# EAGLE design freckle (EAGLE 7.2.0)

## Sheet 1 of 2
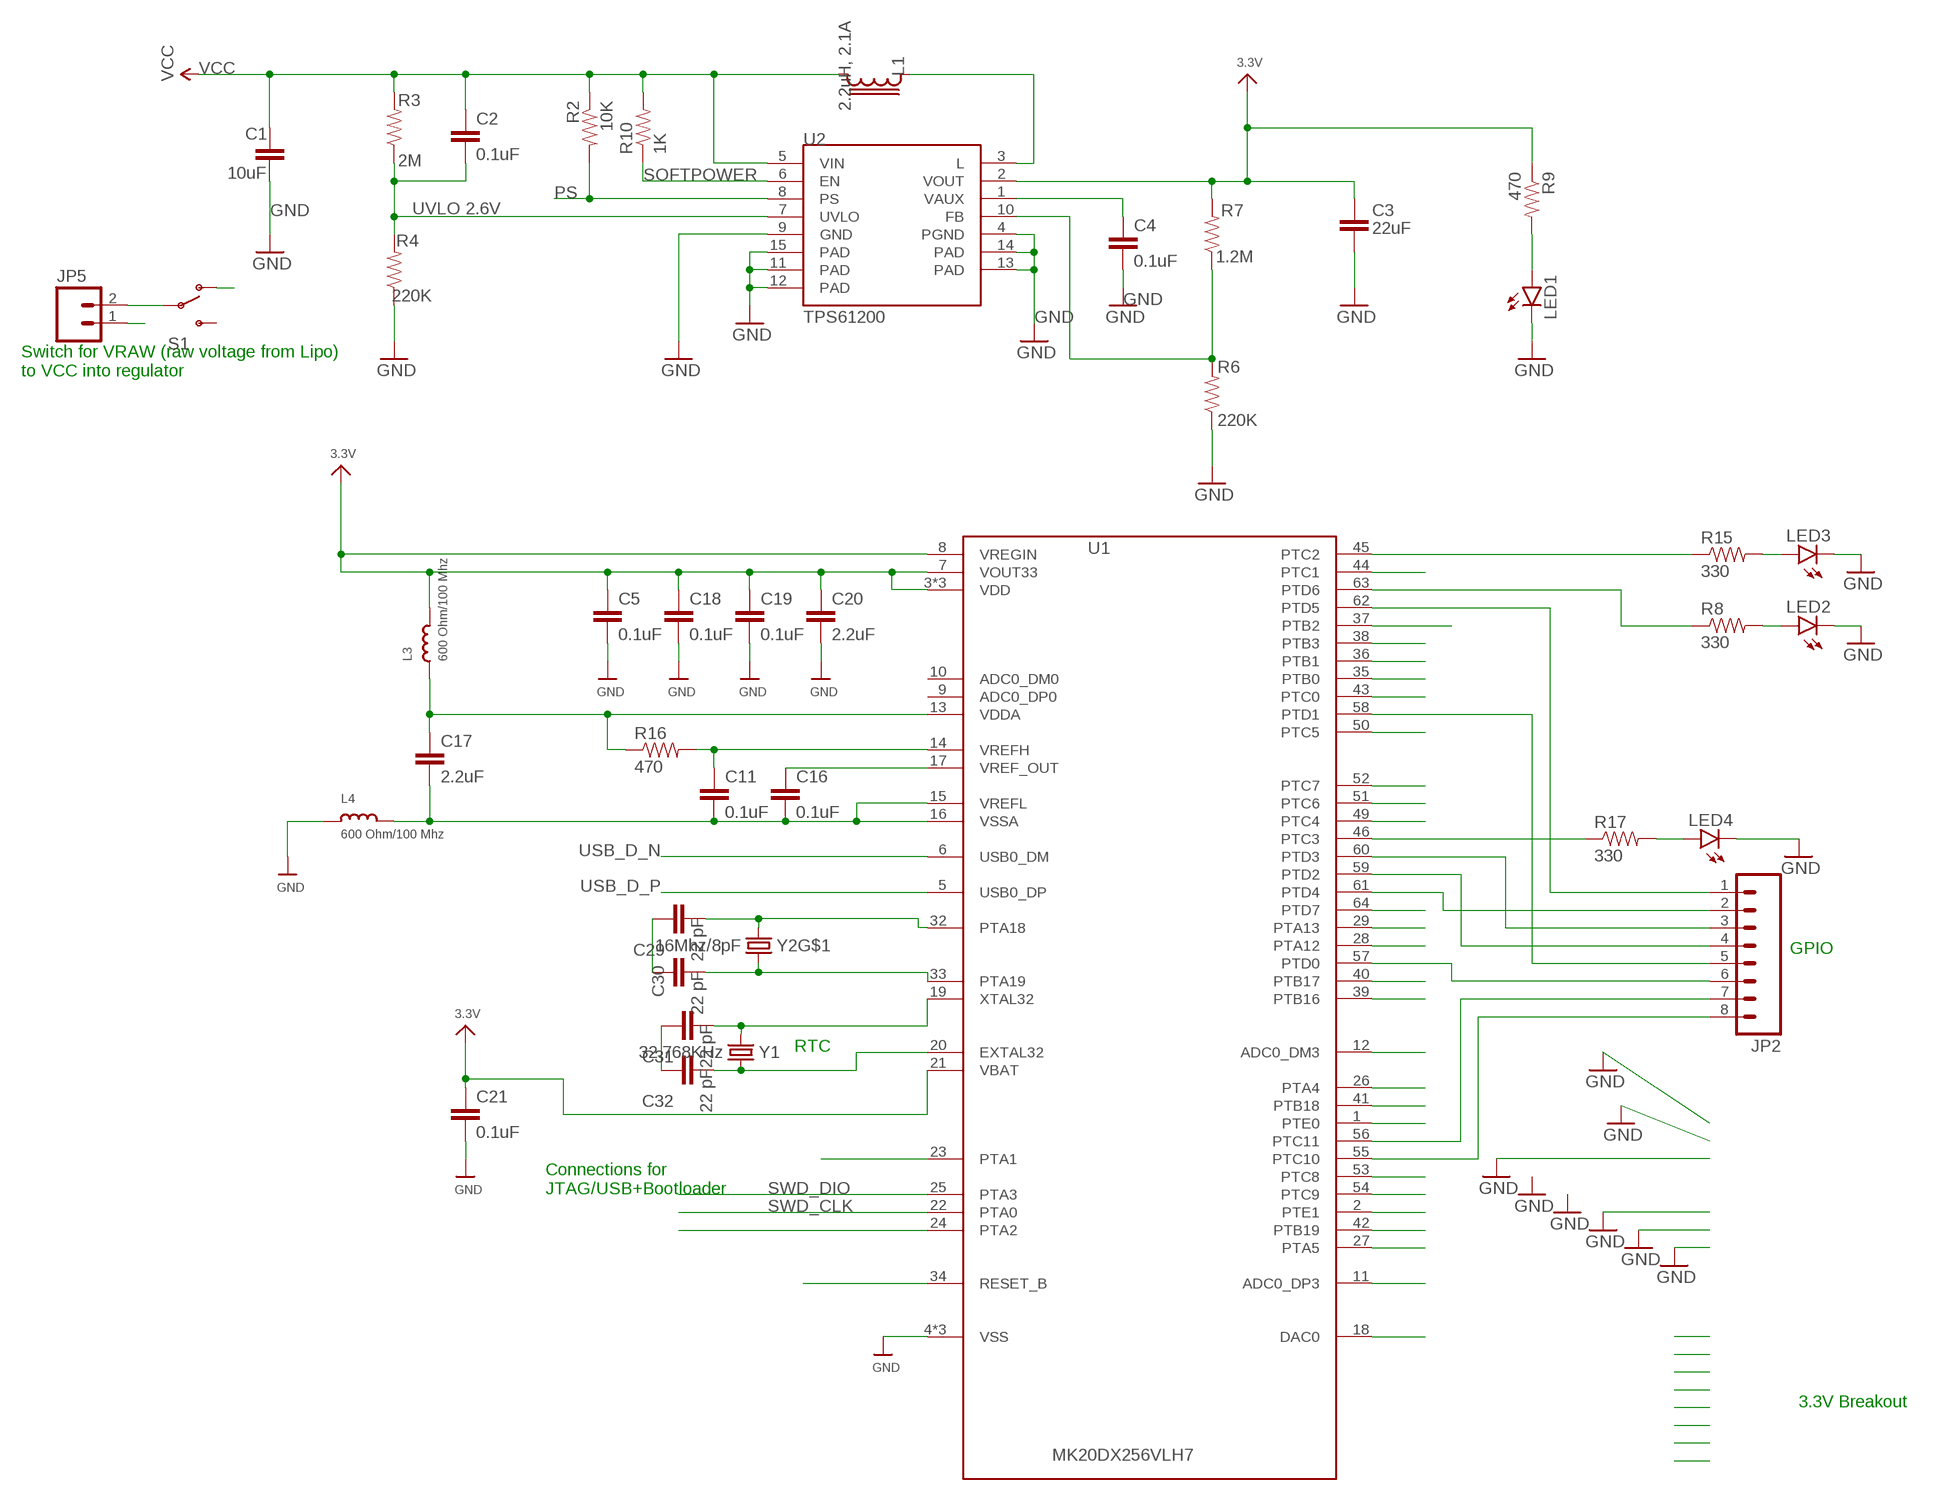
[diagram p0: schematic, sheet 1]

### Parts
C1  10uF  CAPACITOR-10UF  [0603-CAP]
C2  0.1uF  CAPACITOR-0.1UF  [0603-CAP]
C3  22uF  CAPACITOR-22UF  [0603-CAP]
C4  0.1uF  CAPACITOR-0.1UF  [0603-CAP]
C5  0.1uF  CAPACITOR-0.1UF  [0603-CAP]
C11  0.1uF  CAPACITOR-0.1UF  [0603-CAP]
C16  0.1uF  CAPACITOR-0.1UF  [0603-CAP]
C17  2.2uF  CAPACITOR-2.2UF  [0603-CAP]
C18  0.1uF  CAPACITOR-0.1UF  [0603-CAP]
C19  0.1uF  CAPACITOR-0.1UF  [0603-CAP]
C20  2.2uF  CAPACITOR-2.2UF  [0603-CAP]
C21  0.1uF  CAPACITOR-0.1UF  [0603-CAP]
C29  22 pF  CAPACITOR-10UF  [0603-CAP]
C30  22 pF  CAPACITOR-10UF  [0603-CAP]
C31  22 pF  CAPACITOR-10UF  [0603-CAP]
C32  22 pF  CAPACITOR-10UF  [0603-CAP]
JP2  M08SILK_FEMALE_PTH  [1X08]
JP5  M02PTH  [1X02]
L1  2.2uH, 2.1A  LPS30152.2UH  [LPS3015]
L3  600 Ohm/100 Mhz  INDUCTOR-BK2125HM601-T  [0805]
L4  600 Ohm/100 Mhz  INDUCTOR-BK2125HM601-T  [0805]
LED1  LED-GREEN  [LED-0603]
LED2  LED-GREEN  [LED-0603]
LED3  LED-GREEN  [LED-0603]
LED4  LED-GREEN  [LED-0603]
R2  10K  RESISTOR-10K  [0603-RES]
R3  2M  RESISTOR-2M  [0603-RES]
R4  220K  RESISTOR-220K  [0603-RES]
R6  220K  RESISTOR-220K  [0603-RES]
R7  1.2M  RESISTOR-1.2M  [0603-RES]
R8  330  RESISTOR-470  [0603-RES]
R9  470  RESISTOR-470  [0603-RES]
R10  1K  RESISTOR-1K  [0603-RES]
R15  330  RESISTOR-470  [0603-RES]
R16  470  RESISTOR-470  [0603-RES]
R17  330  RESISTOR-470  [0603-RES]
S1  SWITCH-SPDT-SMD-A  [SWITCH-SPST-SMD-A]
U1  MK20DX256VLH7  [MK20DX256VLH7]
U2  TPS61200  [QFN-10_PAD]
Y1  32.768KHz  CRYSTAL/32.768KHZ/SMD-TXC_7A  [CRYSTAL-TXC-7A]
Y2  16Mhz/8pF  CRYSTAL/SMD-5X3-GND16MHZ/8PF  [CRYSTAL-SMD-5X3]

### Nets
3.3V: C3.1 C5.1 C18.1 C19.1 C20.1 C21.1 L3.2 R7.2 R9.1 U1.3(VDD) U1.7(VOUT33) U1.8(VREGIN) U1.21(VBAT) U1.30(VDD) U1.48(VDD) U2.2(VOUT) ; also sheet 2
A12: U1.11(ADC0_DP3)
A13: U1.12(ADC0_DM3)
AD0: U1.39(PTB16) ; also sheet 2
DAC/A14: U1.18(DAC0)
FB: R6.2 R7.1 U2.10(FB)
GND [Top GND Pour]: C1.2 C3.2 C4.2 C5.2 C18.2 C19.2 C20.2 C21.2 C29.1 C30.1 C31.1 C32.1 JP5.1 L4.1 LED1.C LED2.C LED3.C LED4.C R4.1 R6.1 U1.4(VSS) U1.31(VSS) U1.47(VSS) U2.4(PGND) U2.9(GND) U2.11(PAD) U2.12(PAD) U2.13(PAD) U2.14(PAD) U2.15(PAD) ; also sheet 2
ID: U1.23(PTA1)
N$1: LED1.A R9.2
N$2: L1.1 U2.3(L)
N$7: LED2.A R8.2
N$8: LED3.A R15.2
N$9: R17.1 U1.46(PTC3)
N$10: C31.2 U1.19(XTAL32) Y1.P$2
N$11: C32.2 U1.20(EXTAL32) Y1.P$1
N$27: C29.2 U1.32(PTA18) Y2.3
N$28: C30.2 U1.33(PTA19) Y2.1
N$29: LED4.A R17.2
PS: R2.2 U2.8(PS)
PTA2: U1.24(PTA2)
PTA4: U1.26(PTA4)
PTA5: U1.27(PTA5)
PTA12: U1.28(PTA12)
PTA13: U1.29(PTA13)
PTB0: U1.35(PTB0) ; also sheet 2
PTB1: U1.36(PTB1) ; also sheet 2
PTB17: U1.40(PTB17) ; also sheet 2
PTB18: U1.41(PTB18) ; also sheet 2
PTB19: U1.42(PTB19) ; also sheet 2
PTC0: U1.43(PTC0) ; also sheet 2
PTC1: U1.44(PTC1) ; also sheet 2
PTC2: R15.1 U1.45(PTC2)
PTC4: U1.49(PTC4) ; also sheet 2
PTC5: U1.50(PTC5) ; also sheet 2
PTC6: U1.51(PTC6) ; also sheet 2
PTC7: U1.52(PTC7) ; also sheet 2
PTC8: U1.53(PTC8) ; also sheet 2
PTC9: U1.54(PTC9) ; also sheet 2
PTC10: JP2.8 U1.55(PTC10)
PTC11: JP2.7 U1.56(PTC11)
PTD0: JP2.6 U1.57(PTD0)
PTD1: JP2.5 U1.58(PTD1)
PTD2: JP2.4 U1.59(PTD2)
PTD3: JP2.3 U1.60(PTD3)
PTD4: JP2.2 U1.61(PTD4)
PTD5: JP2.1 U1.62(PTD5)
PTD6: R8.1 U1.63(PTD6)
PTD7: U1.64(PTD7)
PTE0: U1.1(PTE0)
PTE1: U1.2(PTE1)
RESET_B: U1.34(RESET_B)
SCL: U1.37(PTB2) ; also sheet 2
SDA: U1.38(PTB3) ; also sheet 2
SOFTPOWER: R10.1 U2.6(EN)
SWD_CLK: U1.22(PTA0)
SWD_DIO: U1.25(PTA3)
USB_D_N [USB]: U1.6(USB0_DM)
USB_D_P [USB]: U1.5(USB0_DP)
UVLO: C2.2 R3.1 R4.2 U2.7(UVLO)
VAUX: C4.1 U2.1(VAUX)
VCC: C1.1 C2.1 L1.2 R2.1 R3.2 R10.2 S1.1(O) U2.5(VIN)
VDDA: C17.1 L3.1 R16.1 U1.13(VDDA)
VRAW [Top GND Pour]: JP5.2 S1.2(P)
VREF_OUT: C16.1 U1.17(VREF_OUT)
VREFH: C11.1 R16.2 U1.14(VREFH)
VREFL: C11.2 C16.2 C17.2 L4.2 U1.15(VREFL) U1.16(VSSA)
Unconnected: S1.3(S) U1.9(ADC0_DP0) U1.10(ADC0_DM0) Y2.2(GND:GND) Y2.4(GND:GND)

### Notes on the sheet
- UVLO 2.6V
- Switch for VRAW (raw voltage from Lipo) 
  to VCC into regulator
- GPIO
- RTC
- Connections for 
  JTAG/USB+Bootloader
- 3.3V Breakout

## Sheet 2 of 2
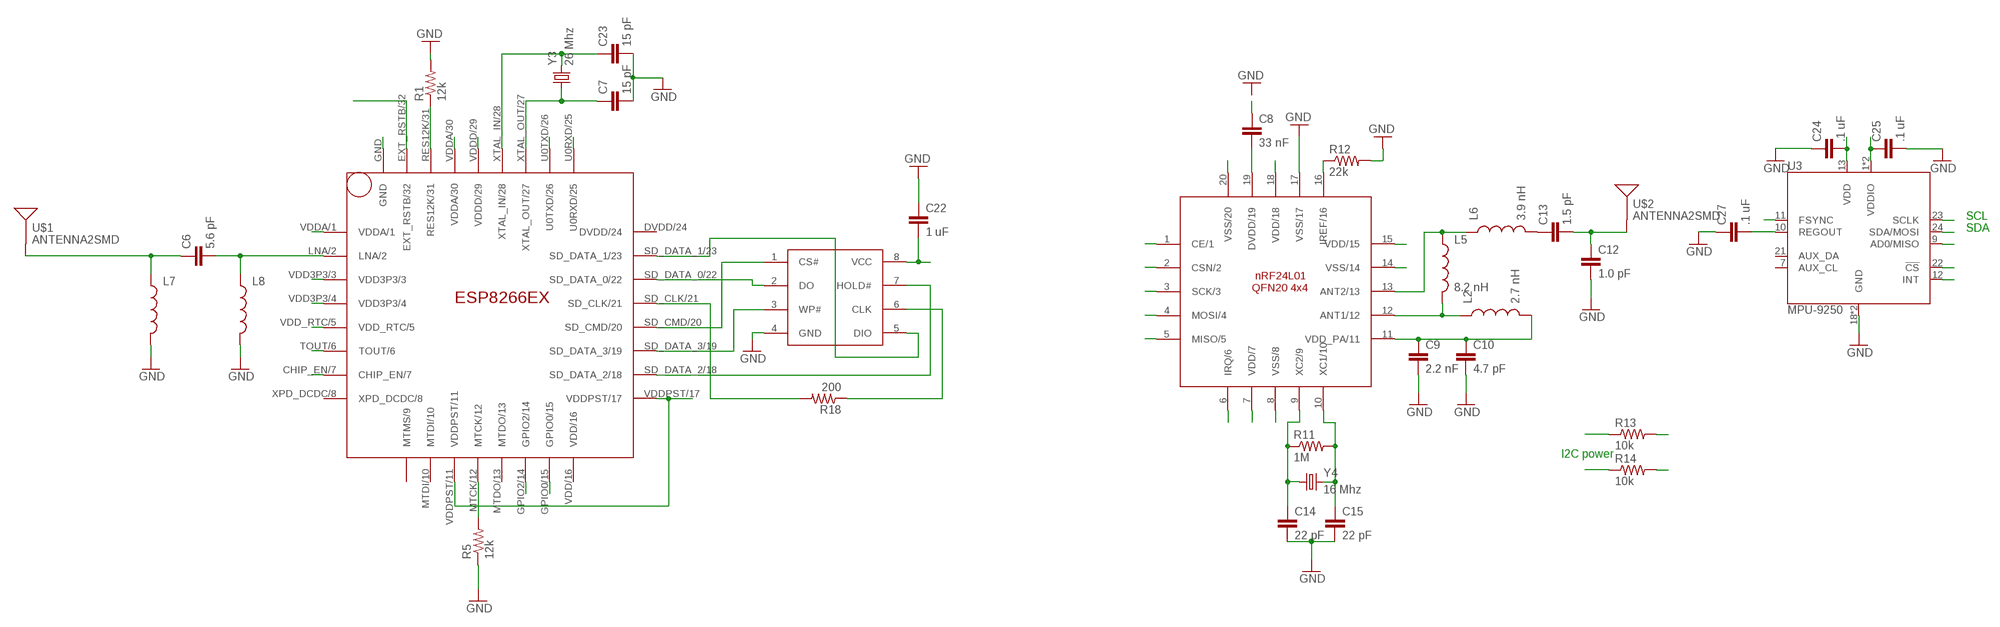
[diagram p1: schematic, sheet 2]

### Parts
C6  5.6 pF  CAP0603-CAP  [0603-CAP]
C7  15 pF  CAP0603-CAP  [0603-CAP]
C8  33 nF  CAP0603-CAP  [0603-CAP]
C9  2.2 nF  CAP0603-CAP  [0603-CAP]
C10  4.7 pF  CAP0603-CAP  [0603-CAP]
C12  1.0 pF  CAP0603-CAP  [0603-CAP]
C13  1.5 pF  CAP0603-CAP  [0603-CAP]
C14  22 pF  CAP0603-CAP  [0603-CAP]
C15  22 pF  CAP0603-CAP  [0603-CAP]
C22  1 uF  CAP0603-CAP  [0603-CAP]
C23  15 pF  CAP0603-CAP  [0603-CAP]
C24  .1 uF  CAP0603-CAP  [0603-CAP]
C25  .1 uF  CAP0603-CAP  [0603-CAP]
C27  .1 uF  CAP0603-CAP  [0603-CAP]
L2  2.7 nH  INDUCTOR0402  [C0402]
L5  8.2 nH  INDUCTOR0402  [C0402]
L6  3.9 nH  INDUCTOR0402  [C0402]
L7  INDUCTOR30OHM,1.8A  [0603]
L8  INDUCTOR30OHM,1.8A  [0603]
R1  12k  RESISTOR0603-RES  [0603-RES]
R5  12k  RESISTOR0603-RES  [0603-RES]
R11  1M  RESISTOR0603-RES  [0603-RES]
R12  22k  RESISTOR0603-RES  [0603-RES]
R13  10k  RESISTOR0603-RES  [0603-RES]
R14  10k  RESISTOR0603-RES  [0603-RES]
R18  200  RESISTOR0603-RES  [0603-RES]
U3  MPU-9250  [QFN-24/3MM]
U$1  ANTENNA2SMD  [ANTENNA-CHIP2]
U$2  ANTENNA2SMD  [ANTENNA-CHIP2]
U$3  25Q40  [SOP8]
U$4  NRF24L01  [QFN20(4X4)]
U$6  ESP8266EX  [QFN32]
Y3  26 Mhz  CRYSTAL5X3  [CRYSTAL-SMD-5X3]
Y4  16 Mhz  CRYSTAL5X3  [CRYSTAL-SMD-5X3]

### Nets
3.3V: C22.2 C24.2 C25.1 R13.1 R14.1 U3.1(VDDIO) U3.8(VDDIO) U3.13(VDD) U3.22(!CS) U$3.8(VCC) U$4.7(VDD/7) U$4.18(VDD/18) U$6.VDD3P3/3 U$6.VDD3P3/4 U$6.VDDA/1 U$6.VDDD/29 U$6.VDDPST/11 U$6.VDDPST/17 ; also sheet 1
AD0: U3.9(AD0/MISO) ; also sheet 1
GND [Top GND Pour]: C7.2 C8.1 C9.2 C10.2 C12.2 C14.2 C15.2 C22.1 C23.2 C24.1 C25.2 C27.1 L7.2 L8.2 R1.2 R5.1 R12.2 U3.18(GND) U3.20(GND) U$3.4(GND) U$4.8(VSS/8) U$4.17(VSS/17) U$4.20(VSS/20) U$6.GND ; also sheet 1
N$13: C6.2 L8.1 U$6.LNA/2
N$16: C6.1 L7.1 U$1.FEED(SIGNAL)
N$17: C14.1 R11.1 U$4.9(XC2/9) Y4.1
N$18: C15.1 R11.2 U$4.10(XC1/10) Y4.3
N$19: C9.1 C10.1 L2.2 U$4.11(VDD_PA/11)
N$20: L5.1 L6.1 U$4.13(ANT2/13)
N$21: C8.2 U$4.19(DVDD/19)
N$23: L2.1 L5.2 U$4.12(ANT1/12)
N$24: R12.1 U$4.16(IREF/16)
N$25: C13.1 L6.2
N$26: C12.1 C13.2 U$2.FEED(SIGNAL)
N$32: R5.2 U$6.MTCK/12
N$34: C27.2 U3.10(REGOUT)
N$35: R18.1 U$3.6(CLK)
N$38: R1.1 U$6.RES12K/31
PTB0: U3.12(INT) ; also sheet 1
PTB1: U3.11(FSYNC) ; also sheet 1
PTB16: U$6.U0RXD/25
PTB17: U$6.U0TXD/26 ; also sheet 1
PTB18: U$6.GPIO0/15 ; also sheet 1
PTB19: U$6.GPIO2/14 ; also sheet 1
PTC0: U$6.EXT_RSTB/32 ; also sheet 1
PTC1: U$6.CHIP_EN/7 ; also sheet 1
PTC4: U$4.2(CSN/2) ; also sheet 1
PTC5: U$4.3(SCK/3) ; also sheet 1
PTC6: U$4.4(MOSI/4) ; also sheet 1
PTC7: U$4.5(MISO/5) ; also sheet 1
PTC8: U$4.6(IRQ/6) ; also sheet 1
PTC9: U$4.1(CE/1) ; also sheet 1
RTC: U$6.VDD_RTC/5
SCL: R14.2 U3.23(SCLK) ; also sheet 1
SD-CLK: R18.2 U$6.SD_CLK/21
SD-CMD: U$3.1(CS#) U$6.SD_CMD/20
SD-D0: U$3.2(DO) U$6.SD_DATA_0/22
SD-D1: U$3.5(DIO) U$6.SD_DATA_1/23
SD-D2: U$3.7(HOLD#) U$6.SD_DATA_2/18
SD-D3: U$3.3(WP#) U$6.SD_DATA_3/19
SDA: R13.2 U3.24(SDA/MOSI) ; also sheet 1
TOUT: U$6.TOUT/6
VDD: U$6.VDDA/30
XTAL_IN: C23.1 U$6.XTAL_IN/28 Y3.3
XTAL_OUT: C7.1 U$6.XTAL_OUT/27 Y3.1
Unconnected: U3.7(AUX_CL) U3.21(AUX_DA) U$4.14(VSS/14) U$4.15(VDD/15) U$6.DVDD/24 U$6.MTDI/10 U$6.MTDO/13 U$6.MTMS/9 U$6.VDD/16 U$6.XPD_DCDC/8

### Notes on the sheet
- SCL
- SDA
- I2C power

## Library data of the parts
C1 = appfruits:CAPACITOR; MF: Murata; MPN: GRM188R60J106ME47D
C2 C4 C5 C11 C16 C18 C19 C21 = appfruits:CAPACITOR; MF: Kemet; MPN: C0603C104J3RACTU
C3 = appfruits:CAPACITOR; MF: Murata; MPN: GRM188R60J226MEA0D
C6-C10 C12-C15 C22-C25 C27 = SparkFun-Capacitors:CAP: Capacitor Standard 0603 ceramic capacitor, and 0.1" leaded capacitor.
C17 C20 = appfruits:CAPACITOR; MF: Kemet; MPN: C0603C225K4PACTU
C29-C32 = appfruits:CAPACITOR; MF: Murata; MPN: GRM188R60J106ME47D; VALUE: 10uF
JP2 = SparkFun-Connectors:M08: Header 8 Standard 8-pin 0.1" header. Use with straight break away headers (SKU : PRT-00116), right angle break away headers (PRT-00553), swiss pins (PRT-00743), machine pins (PRT-00117), and female headers (PRT-00115).; PROD_ID: CONN-08438
JP5 = SparkFun-Connectors:M02: Standard 2-pin 0.1" header. Use with - straight break away headers ( PRT-00116) - right angle break away headers (PRT-00553) - swiss pins (PRT-00743) - machine pins (PRT-00117) - female headers (PRT-00115) Molex polarized connector foot print use with: PRT-08233 with associated crimp pins and housings. 2.54_SCREWTERM for use with PRT-10571. 3.5mm Screw Terminal footprints for PRT-08084 5mm Screw Terminal footprints for use with PRT-08432
L1 = appfruits:LPS3015: Shielded Power Inductor; MF: Coilcraft; MPN: LPS3015-222MRB
L2 L5 L6 = SparkFun-Passives:INDUCTOR: Inductors
L3 L4 = appfruits:INDUCTOR: Inductors; MF: Taiyo Yuden; MPN: BK2125HM601-T
L7 L8 = SparkFun-Passives:INDUCTOR: Inductors; PROD_ID: RES-07859
LED1-LED4 = appfruits:LED: LEDs Standard schematic elements and footprints for 5mm, 3mm, 1206, and 0603 sized LEDs. 5mm - Spark Fun Electronics SKU : COM-00529 (and others); MF: Avago; MPN: HSMG-C190
R1 R5 R11-R14 R18 = SparkFun-Resistors:RESISTOR: Resistor Basic schematic elements and footprints for 0603, 1206, and PTH resistors.
R2 = appfruits:RESISTOR: Resistor Basic schematic elements and footprints for 0603, 1206, and PTH resistors.; MF: Panasonic; MPN: ERJ-3GEYJ103V
R3 = appfruits:RESISTOR: Resistor Basic schematic elements and footprints for 0603, 1206, and PTH resistors.; MF: Panasonic; MPN: ERJ-3GEYJ205V
R4 R6 = appfruits:RESISTOR: Resistor Basic schematic elements and footprints for 0603, 1206, and PTH resistors.; MF: Panasonic; MPN: ERJ-3GEYJ224V
R7 = appfruits:RESISTOR: Resistor Basic schematic elements and footprints for 0603, 1206, and PTH resistors.; MF: Panasonic; MPN: ERJ-3GEYJ125V
R8 R15 R17 = appfruits:RESISTOR: Resistor Basic schematic elements and footprints for 0603, 1206, and PTH resistors.; MF: Panasonic; MPN: ERJ-3GEYJ471V; VALUE: 470
R9 R16 = appfruits:RESISTOR: Resistor Basic schematic elements and footprints for 0603, 1206, and PTH resistors.; MF: Panasonic; MPN: ERJ-3GEYJ471V
R10 = appfruits:RESISTOR: Resistor Basic schematic elements and footprints for 0603, 1206, and PTH resistors.; MF: Panasonic; MPN: ERJ-3GEYJ102V
S1 = SparkFun-Electromechanical:SWITCH-SPDT: SPDT Switch Simple slide switch, Spark Fun Electronics SKU : COM-00102 DPDT SMT slide switch, AYZ0202, SWCH-08179
U1 = appfruits:MK20DX256VLH7; MF: Freescale; MPN: MK20DX256VLH7
U2 = appfruits:TPS61200: DC to DC Booster IC-10035; MF: Texas Instruments; MPN: TPS61200DRCR; PROD_ID: IC-10035
U3 = chips:MPU-9250: GYRO/ACCEL/COMPASS/9-AXIS; DIGIKEY: 1428-1019-1-ND
U$1 U$2 = SparkFun-RF:ANTENNA2: Chip antenna Single endded antenna. Common with smaller chip antennas. CHIP4 package is the GPS Chip Antenna SKU: GPS-08418. CHIP5 package is 2.4GHz chip antenna SKU: WRL-00144.
U$3 = wifi:25Q40
U$4 = RF:NRF24L01
U$6 = wifi:ESP8266EX
Y1 = appfruits:CRYSTAL/32.768KHZ/SMD-TXC_7A; MF: Epson Timing; MPN: FC-255 32.7680K-A3
Y2 = appfruits:CRYSTAL/SMD-5X3-GND; MF: ECS; MPN: ECS-160-8-30B-CKM
Y3 Y4 = SparkFun-FreqCtrl:CRYSTAL: Various standard crystals. Proven footprints.; PROD_ID: XTAL-08218

## Net classes
1 USB: width 0.254 mm, drill 0.33 mm, clearance 0.159 mm

## Board
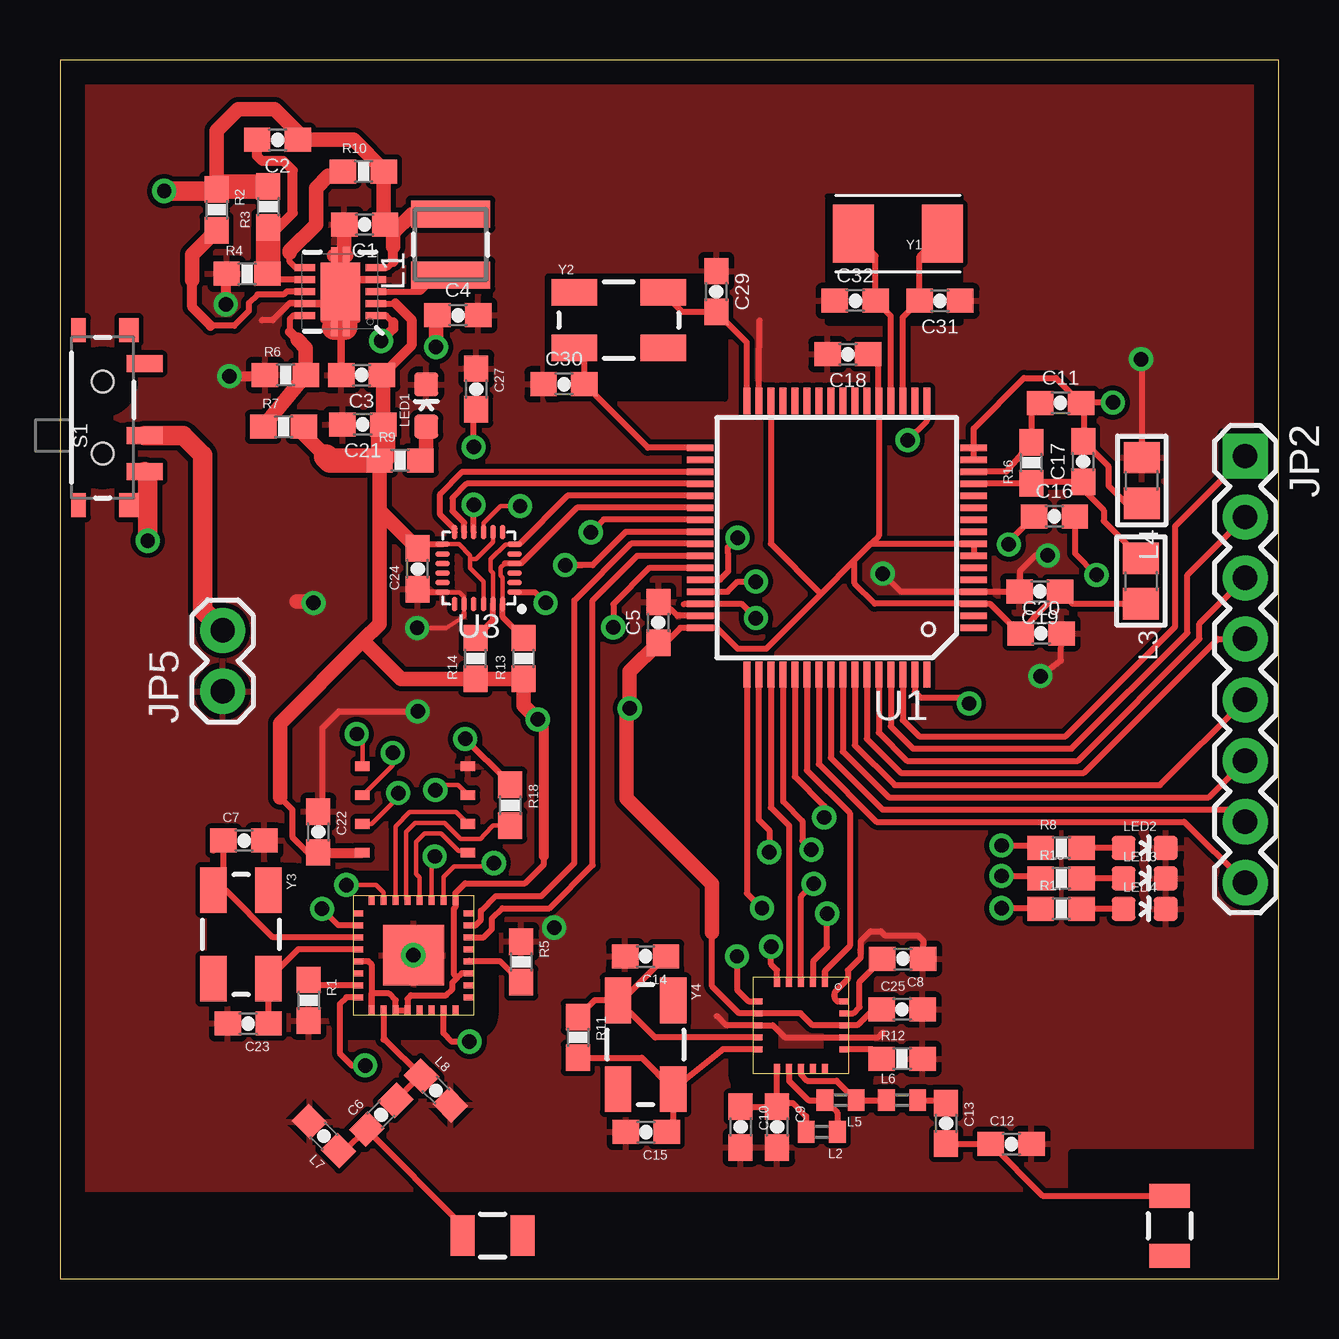
[diagram p2: board, top side]
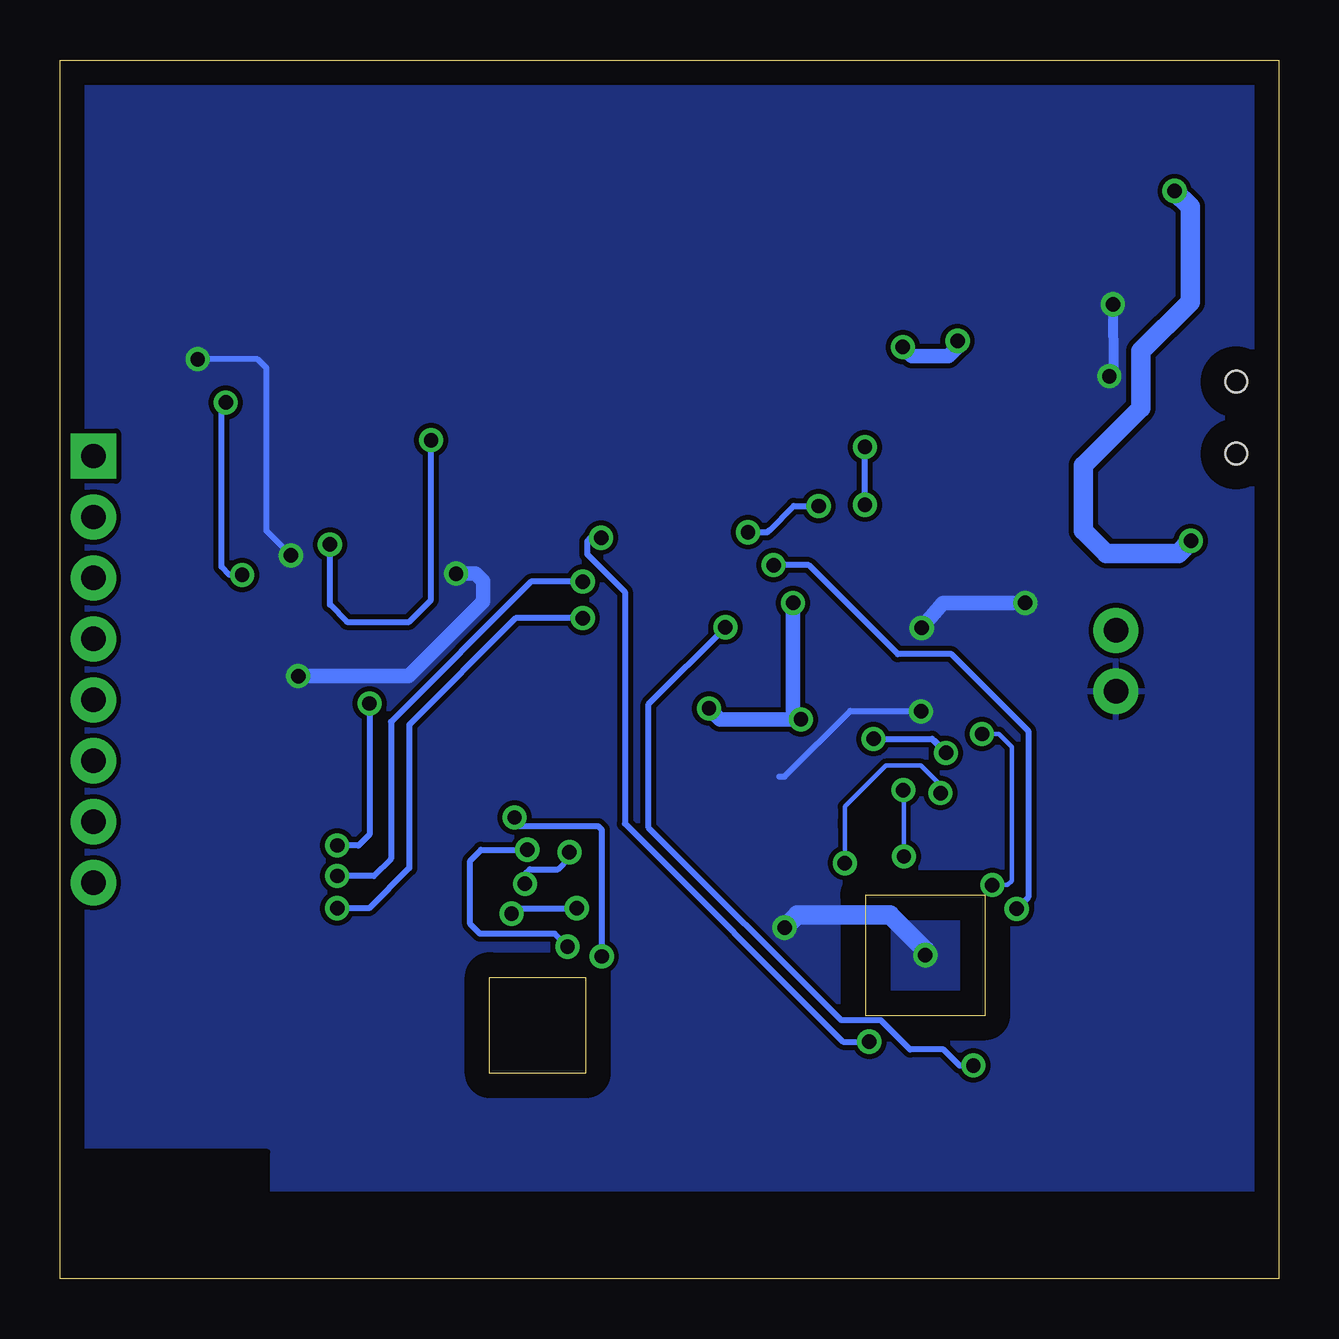
[diagram p3: board, bottom side, seen from below]

Size 50.8 x 50.8 mm. Coordinates in mm from the lower left corner, seen from the top.
Outline: 0,0 50.8,0 50.8,50.8 0,50.8 0,0
Copper layers (1*16): Top 0.035mm / dielectric 1.5mm / Bottom 0.035mm
Design rules "default": minimum track width 10mil, minimum drill 24mil, track to track 8mil, track to pad 8mil, pad to pad 8mil, via to via 8mil, smd to smd 8mil, copper to edge 40mil, drill to drill 8mil, minimum pad ring 10mil, minimum via ring 8mil, stop-mask expansion 4mil, vias tented up to drill 0mil, thermal gap 10mil
tRestrict: area 6.2,11.5 to 9.8,17.2; area 10.6,38.4 to 12.9,43; area 32,39.9 to 37.5,45.1; area 20.3,36.7 to 27.7,41.8; area -0.2,0.2 to 50.7,5.3
bRestrict: area -0.2,0.2 to 50.7,5.3

### Footprints (pad centres in the part's own frame; a part is rotated, then mirrored left to right if it is on the bottom)
0603-CAP = smd 1.1 x 1: 1 -0.85,0; 2 0.85,0
1X08 = drill 1.016 pad 1.88 square: 1 0,0 | drill 1.016 pad 1.88: 2 2.54,0; 3 5.08,0; 4 7.62,0; 5 10.16,0; 6 12.7,0; 7 15.24,0; 8 17.78,0
1X02 = drill 1.016 pad 1.88: 1 0,0; 2 2.54,0
LPS3015 = smd 1.14 x 3.3: 1 -1.27,0; 2 1.27,0
C0402 = smd 0.7 x 0.9: 1 -0.65,0; 2 0.65,0
0805 = smd 1.3 x 1.5: 1 -0.95,0; 2 0.95,0
0603 = smd 1.1 x 1: 1 -0.85,0; 2 0.85,0
LED-0603 = smd 1 x 1: A 0,-0.877; C 0,0.877
0603-RES = smd 1.1 x 1: 1 -0.85,0; 2 0.85,0
SWITCH-SPST-SMD-A = smd 0.7 x 1.5: 1 -2.25,-1.75; 2 -0.75,-1.75; 3 2.25,-1.75 | smd 1 x 0.6: GND1 -3.65,1; GND3 3.65,1 | smd 1 x 0.8: GND2 -3.65,-1.1; GND4 3.65,-1.1 | hole 0.9: -1.5,0; 1.5,0
MK20DX256VLH7 = smd 1.1 x 0.285: 1 -5.7,3.75; 2 -5.7,3.25; 3 -5.7,2.75; 4 -5.7,2.25; 5 -5.7,1.75; 6 -5.7,1.25; 7 -5.7,0.75; 8 -5.7,0.25; 9 -5.7,-0.25; 10 -5.7,-0.75; 11 -5.7,-1.25; 12 -5.7,-1.75; 13 -5.7,-2.25; 14 -5.7,-2.75; 15 -5.7,-3.25; 16 -5.7,-3.75; 33 5.7,-3.75; 34 5.7,-3.25; 35 5.7,-2.75; 36 5.7,-2.25; 37 5.7,-1.75; 38 5.7,-1.25; 39 5.7,-0.75; 40 5.7,-0.25; 41 5.7,0.25; 42 5.7,0.75; 43 5.7,1.25; 44 5.7,1.75; 45 5.7,2.25; 46 5.7,2.75; 47 5.7,3.25; 48 5.7,3.75 | smd 0.285 x 1.1: 17 -3.75,-5.7; 18 -3.25,-5.7; 19 -2.75,-5.7; 20 -2.25,-5.7; 21 -1.75,-5.7; 22 -1.25,-5.7; 23 -0.75,-5.7; 24 -0.25,-5.7; 25 0.25,-5.7; 26 0.75,-5.7; 27 1.25,-5.7; 28 1.75,-5.7; 29 2.25,-5.7; 30 2.75,-5.7; 31 3.25,-5.7; 32 3.75,-5.7; 49 3.75,5.7; 50 3.25,5.7; 51 2.75,5.7; 52 2.25,5.7; 53 1.75,5.7; 54 1.25,5.7; 55 0.75,5.7; 56 0.25,5.7; 57 -0.25,5.7; 58 -0.75,5.7; 59 -1.25,5.7; 60 -1.75,5.7; 61 -2.25,5.7; 62 -2.75,5.7; 63 -3.25,5.7; 64 -3.75,5.7
QFN-10_PAD = smd 0.297 x 0.85: 1 -1,-1.475; 2 -0.5,-1.475; 3 0,-1.475; 4 0.5,-1.475; 5 1,-1.475; 6 1,1.475; 7 0.5,1.475; 8 0,1.475; 9 -0.5,1.475; 10 -1,1.475 | smd 0.7 x 0.28: 11 -1.5,0.25; 12 -1.5,-0.25; 13 1.5,0.25; 14 1.5,-0.25 | smd 2.4 x 1.65: 15 0,0
QFN-24/3MM = smd 0.6 x 0.23: 1 -1.5,1; 2 -1.5,0.6; 3 -1.5,0.2; 4 -1.5,-0.2; 5 -1.5,-0.6; 6 -1.5,-1; 13 1.5,-1; 14 1.5,-0.6; 15 1.5,-0.2; 16 1.5,0.2; 17 1.5,0.6; 18 1.5,1 | smd 0.23 x 0.6: 7 -1,-1.5; 8 -0.6,-1.5; 9 -0.2,-1.5; 10 0.2,-1.5; 11 0.6,-1.5; 12 1,-1.5; 19 1,1.5; 20 0.6,1.5; 21 0.2,1.5; 22 -0.2,1.5; 23 -0.6,1.5; 24 -1,1.5
ANTENNA-CHIP2 = smd 1.7 x 1: FEED 0,1.25; P$2 0,-1.25
SOP8 = smd 0.6 x 0.4: 1 -2.2,1.8; 2 -2.2,0.6; 3 -2.2,-0.6; 4 -2.2,-1.8; 5 2.2,-1.8; 6 2.2,-0.6; 7 2.2,0.6; 8 2.2,1.8
QFN20(4X4) = smd 0.4 x 0.25: 1 -1.8,1; 2 -1.8,0.5; 3 -1.8,0; 4 -1.8,-0.5; 5 -1.8,-1; 11 1.8,-1; 12 1.8,-0.5; 13 1.8,0; 14 1.8,0.5; 15 1.8,1 | smd 0.25 x 0.4: 6 -1,-1.8; 7 -0.5,-1.8; 8 0,-1.8; 9 0.5,-1.8; 10 1,-1.8; 16 1,1.8; 17 0.5,1.8; 18 0,1.8; 19 -0.5,1.8; 20 -1,1.8
QFN32 = smd 0.4 x 0.25: CHIP_EN/7 -2.3,-1.25; DVDD/24 2.3,1.75; LNA/2 -2.3,1.25; SD_CLK/21 2.3,0.25; SD_CMD/20 2.3,-0.25; SD_DATA_0/22 2.3,0.75; SD_DATA_1/23 2.3,1.25; SD_DATA_2/18 2.3,-1.25; SD_DATA_3/19 2.3,-0.75; TOUT/6 -2.3,-0.75; VDD3P3/3 -2.3,0.75; VDD3P3/4 -2.3,0.25; VDD_RTC/5 -2.3,-0.25; VDDA/1 -2.3,1.75; VDDPST/17 2.3,-1.75; XPD_DCDC/8 -2.3,-1.75 | smd 0.25 x 0.4: EXT_RSTB/32 -1.75,2.3; GPIO0/15 1.25,-2.3; GPIO2/14 0.75,-2.3; MTCK/12 -0.25,-2.3; MTDI/10 -1.25,-2.3; MTDO/13 0.25,-2.3; MTMS/9 -1.75,-2.3; RES12K/31 -1.25,2.3; U0RXD/25 1.75,2.3; U0TXD/26 1.25,2.3; VDD/16 1.75,-2.3; VDDA/30 -0.75,2.3; VDDD/29 -0.25,2.3; VDDPST/11 -0.75,-2.3; XTAL_IN/28 0.25,2.3; XTAL_OUT/27 0.75,2.3 | smd 2.54 x 2.54: GND 0,0
CRYSTAL-TXC-7A = smd 1.7 x 2.4: P$1 1.85,0; P$2 -1.85,0
CRYSTAL-SMD-5X3 = smd 1.9 x 1.1: 1 -1.85,-1.15; 2 1.85,-1.15; 3 1.85,1.15; 4 -1.85,1.15

### Placement (x,y rotation side)
C1  12.7,43.94 180 top
C2  9.07,47.47 180 top
C3  12.57,37.67 180 top
C4  16.59,40.16 0 top
C5  24.94,27.36 90 top
C6  13.39,6.83 45 top
C7  7.67,18.26 0 top
C8  35.13,13.34 180 top
C9  29.9,6.32 270 top
C10  28.37,6.32 270 top
C11  41.71,36.5 0 top
C12  39.65,5.61 0 top
C13  36.93,6.48 270 top
C14  24.41,13.44 180 top
C15  24.43,6.12 180 top
C16  41.45,31.78 0 top
C17  42.65,34.06 90 top
C18  32.84,38.53 180 top
C19  40.84,28.65 180 top
C20  40.89,26.9 0 top
C21  12.62,35.61 180 top
C22  10.77,18.62 270 top
C23  7.85,10.64 180 top
C24  14.91,29.59 90 top
C25  35.1,11.23 0 top
C27  17.35,37.08 270 top
C29  27.36,41.15 270 top
C30  21.01,37.29 0 top
C31  36.68,40.77 180 top
C32  33.15,40.77 0 top
JP2  49.4,34.29 270 top
JP5  6.78,24.49 90 top
L1  16.28,43.1 90 top
L2  31.75,6.12 180 top
L3  45.06,29.08 270 top
L4  45.09,33.27 270 top
L5  32.54,7.44 180 top
L6  35.1,7.44 0 top
L7  11,5.94 135 top
L8  15.67,7.85 315 top
LED1  15.27,36.4 0 top
LED2  45.21,17.96 270 top
LED3  45.21,16.69 270 top
LED4  45.21,15.42 270 top
R1  10.36,11.61 270 top
R2  6.53,44.55 270 top
R3  8.69,44.68 90 top
R4  7.8,41.88 0 top
R5  19.23,13.21 270 top
R6  9.4,37.67 0 top
R7  9.32,35.51 0 top
R8  41.73,17.96 0 top
R9  14.17,34.11 0 top
R10  12.65,46.15 0 top
R11  21.59,10.06 270 top
R12  35.1,9.17 0 top
R13  19.33,25.86 90 top
R14  17.32,25.86 90 top
R15  41.73,16.69 0 top
R16  40.49,34.01 90 top
R17  41.73,15.42 0 top
R18  18.77,19.74 270 top
S1  1.78,35.89 90 top
U1  32.38,30.89 180 top
U2  11.68,41.15 90 top
U3  17.45,29.62 180 top
U$1  18.03,1.8 90 top
U$2  46.25,2.21 0 top
U$3  14.81,19.56 180 top
U$4  30.89,10.57 270 top
U$6  14.73,13.49 90 top
Y1  34.92,43.56 180 top
Y2  23.29,39.95 0 top
Y3  7.54,14.35 270 top
Y4  24.41,9.75 270 top

### Tracks (layer width: path | path; a pad name or v marks a point on that pad's centre or on a via)
3.3V  (via drill 0.6)
  Top 0.178: U3.22 17.65,29.06 17.09,29.62 17.09,30 | 17.09,30 17.09,30.15 16.63,30.62 U3.13 | U3.8 18.06,31.11 18.06,30.71 17.35,30 17.09,30
  Top 0.254: C25.1 33.9,11.23 33.24,10.57 U$4.18 31.37,10.57 30.87,11.07 U$4.7 28.3,11.07 27.18,12.19 27.18,14.43 | C18.1 34.12,38.1 U1.21 34.13,30.96 33.81,30.64 | C5.1 25.24,26.51 25.86,27.13 26.68,27.13 U1.48 27.37,27.14 28.25,26.26 29.44,26.26 31.73,28.55 | U1.3 | U1.3 38.76,28.14 40.12,26.78 C20.1 40.62,27.57 C19.1 42.21,28.13 L3.2 | U1.7 U1.8 33.81,30.64 | U1.3 33.96,28.14 33.12,28.98 33.12,29.95 | 33.12,29.95 33.81,30.64 | 31.73,28.55 33.12,29.95 | U1.30 29.64,30.64 31.73,28.55 | C24.2 15.09,30.62 U3.13 | U$6.VDDPST/11 16.75,12.74 16.56,12.55 | U$6.VDDD/29 12.85,13.24 12.98,13.1 U$6.VDDA/1 12.98,11.89 13.72,11.89 13.99,11.61 13.99,11.2 U$6.VDD3P3/3 U$6.VDD3P3/4 14.48,11.66 14.63,11.81 16.1,11.81 16.36,12.06 16.36,12.34 16.56,12.55 | 16.56,12.55 16.41,12.7 16.41,15.42 16.48,15.49 U$6.VDDPST/17 16.48,16.08 16.89,16.48 19.38,16.48 20.17,17.27 20.17,17.6 | 9.17,20.07 9.68,19.56 9.68,18.41 10.32,17.77 C22.2 | U3.1 19.8,28.62 v20.24,28.17 | U2.2 13.99,40.65
  Top 0.406: C22.2 10.78,17.76 U$3.8 | 13.99,40.65 14.66,39.98 14.66,38.9 C3.1 | 20.17,17.6 20.17,23.06 v19.91,23.32
  Top 0.61: R7.2 10.17,35.19 11.1,34.27 | 13.51,34.77 13.51,35.57 C21.1 13.47,37.62 C3.1 | R9.1 13.32,32.03 | 13.32,32.03 C24.2 | 13.32,32.03 13.32,27.29 12.62,26.59 | 12.62,26.59 9.17,23.14 9.17,20.07 | 12.62,26.59 14.21,25.01 R14.1 R13.1 19.33,23.9 v19.91,23.32 | 27.18,14.43 27.18,16.46 23.62,20.02 23.62,23.65 v23.75,23.77 23.75,25.31 C5.1
  Top 1.016: 11.1,34.27 11.25,34.11 R9.1 13.47,34.26 C21.1
  Bottom 0.61: v23.75,23.77 23.29,23.32 v19.91,23.32 20.24,23.65 v20.24,28.17
AD0  (via drill 0.6)
  Top 0.178: U3.9 17.65,31.5 18.36,32.21 v19.18,32.21
  Top 0.254: U1.39 22.66,31.65 v22.12,31.11
  Bottom 0.254: v19.18,32.21 20.22,32.21 21.23,31.19 21.26,31.17 21.31,31.11 v22.12,31.11
FB
  Top 0.254: U2.10 9.72,40.15 9.58,40.01 9.58,39.47
  Top 0.406: 9.58,39.47 9.91,39.14
  Top 0.61: R7.1 R6.2 10.25,38.8 9.91,39.14
GND  (via drill 0.6)
  Top 0.178: U3.18 15.97,28.6 16.66,28.6 16.85,28.41 U3.20 16.84,28.11 16.84,27.61 16.1,27.13 v14.88,27.13 | 11.89,39.65 U2.12
  Top 0.254: 34.29,10.26 34.09,10.07 U$4.17 30.22,10.07 29.72,10.57 U$4.8 27.76,10.57 27.38,10.95 | U1.31 29.14,37.64 29.16,39.95 | U1.47 25.73,27.64 25.16,28.21 C5.2 | U1.4 C19.2 | C19.2 39.97,28.63 35.08,28.63 v34.29,29.39 | v40.87,25.12 41.72,25.77 C20.2 | C24.1 15.03,28.62 U3.18 | C19.2 40.03,28.69 40.03,29.52 40.66,30.15 v41.17,30.15 | v45.06,38.33 45.09,38.3 L4.1 | U2.9 10.19,40.66 9.58,40.66 8.87,39.95 8.41,39.95 | C22.1 10.95,19.65 10.95,22.96 11.63,23.65 v14.91,23.65 14.78,23.65 | U$4.20 32.68,11.56 32.41,11.56 32.36,11.61 arc-45 32.28,11.79 32.28,11.84 arc-45 32.35,12.01 32.84,12.5 32.84,12.85 33.38,13.39 33.38,14.07 33.78,14.48 34.21,14.48 34.39,14.3 35.76,14.3 35.99,14.07 35.99,13.92 35.98,13.91 C8.1 | R5.1 19.24,14.05
  Top 0.305: U2.9 11.12,40.64 11.12,41.15 U2.15 12.18,41.65 U2.4 | C3.2 11.72,39.44 U2.12
  Top 0.406: U2.13 12.12,41.97 12.12,41.38 11.89,41.15 U2.15 | R4.1 6.91,41.85 v6.91,40.62 | v7.06,37.62 8.52,37.63 R6.1
  Top 0.61: v10.57,28.17 10.52,28.22 9.86,28.22 | C1.2 11.85,42.65 | 11.85,42.65 U2.13 | 11.85,42.65 U2.14
  Top 1.016: 11.89,41.15 11.89,39.65 U2.11
  Bottom 0.254: v41.17,30.15 42.19,31.17 42.19,37.95 42.57,38.33 v45.06,38.33 | 20.83,20.93 20.6,20.93 17.86,23.67 14.94,23.67 v14.91,23.65 | 20.75,14.48 v20.6,14.63 | 16.2,15.16 15.9,15.16
  Bottom 0.406: v6.91,40.62 6.88,37.82 v7.06,37.62
  Bottom 0.61: v14.88,27.13 13.99,28.17 v10.57,28.17 | v34.29,29.39 33.48,29.39 33.17,29.08 33.17,28.22 36.27,25.12 v40.87,25.12
  Bottom 0.813: U$6.GND 14.73,13.69 16.2,15.16 20.07,15.16 v20.6,14.63
  other vias: 14.73,13.49
  pour Top: -1.27,128.65 128.65,128.65 128.65,-0.76 -12.45,-8.89
  pour Bottom: -3.68,128.02 127.64,128.02 127.64,-0.64 -10.49,-6.78
N$1
  Top 0.61: R9.2 15.27,34.35 LED1.A
N$2
  Top 0.254: U2.3 15.06,41.15 15.75,41.83 L1.1
N$7
  Top 0.254: LED2.A R8.2
N$8
  Top 0.254: LED3.A R15.2
N$9  (via drill 0.6)
  Top 0.254: 26.01,28.12 26.67,28.12 U1.46 28.4,28.14 v29.01,27.53 | R17.1 40.86,15.44 v39.24,15.44
  Bottom 0.254: 39.06,15.44 v39.24,15.44 37.92,15.44 36.25,17.12 36.25,23.09 31.8,27.53 v29.01,27.53
N$10
  Top 0.254: U1.19 35.13,40.07 C31.2 35.83,42.61 Y1.P$2
N$11
  Top 0.254: U1.20 34.63,40.13 C32.2 34,42.64 Y1.P$1
N$13
  Top 0.254: U$6.LNA/2 13.48,9.96 13.56,9.96 L8.1 15,8.45 C6.2
N$16
  Top 0.254: U$1.FEED 16.78,2.21 C6.1 11.9,5.34 L7.1
N$17
  Top 0.254: U$4.9 29.08,10.06 24.8,10.06 Y4.1 | Y4.1 23.26,11.74 23.56,11.74 C14.1 | Y4.1 22.29,11.6 R11.1
N$18
  Top 0.254: U$4.10 27.63,9.57 Y4.3 | R11.2 24.25,9.21 Y4.3 | Y4.3 25.56,5.99 C15.1
N$19
  Top 0.254: C10.1 C9.1 | C9.1 29.89,7.68 U$4.11 | C9.1 29.9,7.33 30.55,7.33 31.1,6.77 L2.2
N$20
  Top 0.254: U$4.13 30.89,8.51 31.14,8.26 32.38,8.26 L5.1 L6.1
N$21
  Top 0.254: U$4.19 33.06,11.07 33.33,11.33 33.33,12.38 C8.2
N$23
  Top 0.254: U$4.12 30.39,8.25 31.19,7.44 L5.2 32.4,6.93 L2.1
N$24
  Top 0.254: R12.1 33.86,9.57 U$4.16
N$25
  Top 0.254: L6.2 36.82,7.44 C13.1
N$26
  Top 0.254: C13.2 38.79,5.63 C12.1 40.95,3.46 U$2.FEED
N$27
  Top 0.254: 25.26,40.98 Y2.3 25.95,40.3 C29.2 28.64,39.02 U1.32
N$28
  Top 0.254: 21.22,38.59 Y2.1 21.86,38.39 C30.2 24.51,34.64 U1.33
N$29
  Top 0.254: LED4.A R17.2
N$30
  Top 0.254: 11.79,39.93 11.76,39.93 11.76,39.98
N$32
  Top 0.254: 17.04,13.25 17.05,13.26 | U$6.MTCK/12 17.04,13.25 | 17.04,13.25 18.34,13.25 R5.2
N$34  (via drill 0.6)
  Top 0.254: U3.10 v17.25,32.26 | v17.25,34.67 17.25,36.13 C27.2
  Bottom 0.254: v17.25,32.26 v17.25,34.67
N$35  (via drill 0.6)
  Top 0.178: U$3.6 12.62,20.14 13.87,21.39 v13.87,21.92 | R18.1 18.67,20.69
  Top 0.254: 18.67,20.69 18.67,20.73 v16.89,22.5
  Bottom 0.178: v13.87,21.92 13.87,22 14.33,22.45
  Bottom 0.254: v16.89,22.5 14.45,22.5 v13.87,21.92
N$36
  Top 0.178: 11.02,39.93 10.95,39.93
N$37
  Top 0.178: 12.39,39.93 12.42,39.93
N$38
  Top 0.254: U$6.RES12K/31 10.58,12.24 R1.1
PS
  Top 0.254: U2.8 10.18,41.12 10.16,41.15 9.45,41.15 9.32,41.02 8.23,41.02 7.87,40.66 7.87,40.34 7.26,39.73 6.27,39.73
  Top 0.406: 6.27,39.73 5.51,40.49 5.51,41.63
  Top 0.61: 5.51,41.63 5.51,42.69 R2.2
PTB0
  Top 0.254: U3.12 16.45,31.25 15.85,31.85 15.85,32.72 16.77,33.64 U1.35
PTB1
  Top 0.254: U3.11 16.85,31.51 16.36,32 16.36,32.54 16.96,33.14 U1.36
PTB17  (via drill 0.6)
  Top 0.254: U$6.U0TXD/26 11.6,14.74 v10.92,15.42 | 21.74,29.74 v21.06,29.74 22.2,29.74 23.59,31.14 U1.40
  Bottom 0.254: v10.92,15.42 10.44,15.9 10.44,22.84 13.64,26.04 15.88,26.04 19.58,29.74 v21.06,29.74
PTB18
  Top 0.254: U1.41 23.8,30.64 21.44,28.27 21.44,17.32 20.07,15.95 18.16,15.95 17.55,15.34 17.55,14.96 17.33,14.74 U$6.GPIO0/15
PTB19
  Top 0.254: U$6.GPIO2/14 17.67,14.24 18.01,14.58 18.01,15.01 18.44,15.44 20.4,15.44 22.2,17.25 22.2,28.27 24.07,30.14 U1.42
PTC0  (via drill 0.6)
  Top 0.254: U$6.EXT_RSTB/32 11.94,11.73 11.66,11.46 11.66,9.4 12.17,8.89 v12.72,8.89 | U1.43 24.58,29.64 23.06,28.12 v23.06,27.15
  Bottom 0.254: v12.72,8.89 13.31,8.89 13.97,9.55 15.37,9.55 16.59,10.77 18.24,10.77 26.26,18.8 26.26,23.95 v23.06,27.15
PTC1  (via drill 0.6)
  Top 0.254: U1.44 27.51,29.14 27.86,29.49 27.86,30.23 27.84,30.25 27.84,30.48 v28.25,30.89 | v17.07,9.88 16.33,9.88 15.98,10.23 U$6.CHIP_EN/7
  Bottom 0.254: v28.25,30.89 28.68,30.89 28.83,30.73 28.83,30.2 27.25,28.63 27.25,18.97 18.16,9.88 v17.07,9.88
PTC2  (via drill 0.6)
  Top 0.254: U1.45 27.82,28.64 28.25,29.06 v29.01,29.06 | v39.24,16.79 40.78,16.79 R15.1
  Bottom 0.254: v29.01,29.06 31.17,29.06 37.01,23.22 37.01,17.5 37.72,16.79 v39.24,16.79
PTC4  (via drill 0.6)
  Top 0.254: U$4.2 31.39,13.22 31.98,13.82 v31.98,15.21 | v29.26,15.44 28.64,16.07 U1.49
  Bottom 0.254: v31.98,15.21 31.75,15.44 v29.26,15.44
PTC5  (via drill 0.6)
  Top 0.254: U$4.3 30.89,15.93 v31.42,16.46 | U1.50 29.14,19.12 29.57,18.69 v29.57,17.78
  Bottom 0.254: v31.42,16.46 31.42,16.87 31.22,17.07 30.05,17.07 29.57,17.55 v29.57,17.78
PTC6
  Top 0.254: U1.51 29.64,19.64 30.39,18.89 U$4.4
PTC7  (via drill 0.6)
  Top 0.254: U$4.5 29.9,12.85 29.64,13.11 v29.64,13.84 | v31.32,17.88 30.95,18.25 30.95,19.09 30.15,19.89 30.15,25.17 U1.52
  Bottom 0.254: v29.64,13.84 30.18,14.38 33.3,14.38 33.71,14.78 33.71,17.42 33.25,17.88 v31.32,17.88
PTC8  (via drill 0.6)
  Top 0.254: 28.92,11.57 U$4.6 28.69,11.57 28.22,12.04 v28.22,13.44 | U1.53 30.64,20.93 31.85,19.71 v31.85,19.23
  Bottom 0.254: v31.85,19.23 31.85,19.05 31.67,18.87 28.37,18.87 28.22,18.72 v28.22,13.44
PTC9
  Top 0.254: 31.89,12.73 U$4.1 31.89,12.84 32.92,13.87 32.92,19.41 31.14,21.19 U1.54
PTC10
  Top 0.254: U1.55 31.64,21.45 34.04,19.05 46.86,19.05 JP2.8
PTC11
  Top 0.254: U1.56 32.13,21.71 34.29,19.56 48.9,19.56 JP2.7
PTD0
  Top 0.254: U1.57 32.63,21.98 34.54,20.07 47.88,20.07 JP2.6
PTD1
  Top 0.254: U1.58 33.13,22.24 34.8,20.57 45.85,20.57 JP2.5
PTD2
  Top 0.254: U1.59 33.63,22.5 35.05,21.08 42.67,21.08 48.26,26.67 JP2.4
PTD3
  Top 0.254: U1.60 34.13,22.76 35.31,21.59 42.42,21.59 47.5,26.67 47.5,27.3 JP2.3
PTD4
  Top 0.254: U1.61 34.63,23.02 35.56,22.1 42.16,22.1 46.99,26.92 46.99,29.34 JP2.2
PTD5
  Top 0.254: U1.62 35.13,23.29 35.81,22.61 41.91,22.61 46.48,27.18 46.48,31.37 JP2.1
PTD6  (via drill 0.6)
  Top 0.254: U1.63 35.63,24.46 35.87,24.23 37.64,24.23 v37.9,23.98 | v39.24,18.06 40.78,18.06 R8.1
  Bottom 0.254: v37.9,23.98 37.9,18.52 38.35,18.06 v39.24,18.06
SCL
  Top 0.178: 17.45,26.9 18.05,27.5 U3.23 18.05,29.42 17.96,29.52 17.96,30 18.57,30.61 18.77,30.61
  Top 0.254: R14.2 18.05,27.43 U3.23 | U1.37 21.16,32.64 19.13,30.61 18.77,30.61
SD-CLK
  Top 0.178: R18.2 18.05,18.89 17.7,18.52 17.53,18.34 16.69,18.34 16.03,19 14.81,19 14.43,18.62 14.43,15.84 U$6.SD_CLK/21
SD-CMD
  Top 0.178: U$3.1 16.93,17.83 16.61,17.83 15.88,18.57 15.19,18.57 14.83,18.21 14.83,16.87 14.98,16.72 U$6.SD_CMD/20
SD-D0
  Top 0.178: U$3.2 16.51,19.46 14.58,19.46 13.98,18.86 U$6.SD_DATA_0/22
SD-D1  (via drill 0.6)
  Top 0.178: U$6.SD_DATA_1/23 13.48,16.11 13.18,16.41 v11.94,16.41 | U$3.5 12.61,22.47 v12.37,22.71
  Bottom 0.178: 11.99,22.71 v12.37,22.71 11.66,22.71 11.12,22.17 11.12,16.59 11.3,16.41 v11.94,16.41
SD-D2  (via drill 0.6)
  Top 0.178: U$3.7 12.99,18.96 14.1,20.06 v14.1,20.24 | 16,15.81 U$6.SD_DATA_2/18 15.98,16.74 16.43,17.2 17.96,17.2 v18.09,17.32
  Bottom 0.178: v14.1,20.24 14.1,20.57 14.91,21.39 16.38,21.39 18.09,19.68 18.09,19.1 18.09,18.87 v18.09,17.32
SD-D3  (via drill 0.6)
  Top 0.178: 15.49,15.8 U$6.SD_DATA_3/19 15.48,17.46 v15.62,17.6 | v15.65,20.37 15.85,20.57 16.59,20.57 U$3.3
  Bottom 0.178: v15.62,17.6 15.62,20.34 v15.65,20.37
SDA
  Top 0.178: 18.54,29.82 18.36,29.64 18.36,29.31 18.45,29.23 U3.24
  Top 0.254: R13.2 18.45,27.59 U3.24 | U1.38 21.55,32.14 19.23,29.82 18.54,29.82
SOFTPOWER
  Top 0.254: U2.6 9.82,42.15 9.58,42.39 9.58,42.77
  Top 0.61: 9.58,42.77 9.58,42.85 10.67,43.94 10.67,45.47 11.18,45.97 11.62,45.97 R10.1
UVLO
  Top 0.254: U2.7 8.88,41.65 R4.2
  Top 0.406: R3.1 9.11,43.83 9.7,44.42 9.7,46.2 9.32,46.58 8.43,46.58 8.22,46.8 C2.2
  Top 1.016: R4.2 8.69,41.92 R3.1
VAUX  (via drill 0.6)
  Top 0.254: U2.1 13.6,40.15 13.89,39.85
  Top 0.406: 13.89,39.85 13.89,39.6 v13.39,39.09
  Top 0.61: v15.67,38.84 15.67,40.09 C4.1
  Bottom 0.61: v15.67,38.84 15.29,38.46 13.77,38.46 13.39,38.84 v13.39,39.09
VCC  (via drill 0.6)
  Top 0.254: U2.5 13.65,42.15 13.89,42.39
  Top 0.406: 13.89,42.39 13.89,43.03
  Top 0.61: 13.89,43.03 13.89,43.6 | 13.89,43.6 C1.1 13.5,43.99 R10.2 13.5,46.22 12.24,47.47 C2.1 9.92,47.77 8.94,48.74 7.42,48.74 6.53,47.85 R2.1 | 13.89,43.6 14.67,44.37 L1.2
  Top 0.813: v4.34,45.34 6.46,45.34 R2.1 | S1.1 3.66,33.51 v3.66,30.76
  Top 1.016: R10.2 13.55,46.1 | R2.1 6.66,45.53 R3.2
  Bottom 0.813: v3.66,30.76 4.19,30.23 7.19,30.23 8.15,31.19 8.15,33.88 5.74,36.3 5.74,38.66 3.68,40.72 3.68,44.68 v4.34,45.34
VDDA
  Top 0.254: 40.51,33.01 R16.1 | R16.1 40.33,33.14 U1.13 | L3.1 43.51,31.58 43.51,32.03 42.7,32.84 C17.1 40.54,33.21 R16.1
VRAW
  Top 0.813: S1.2 5.14,35.14 5.94,34.34 5.94,27.86 JP5.2
VREF_OUT  (via drill 0.6)
  Top 0.254: U1.17 36.13,35.75 v35.33,34.95 | C16.1 39.55,30.72 v39.55,30.61
  Bottom 0.254: v35.33,34.95 35.33,28.3 36.25,27.38 38.84,27.38 39.55,28.09 v39.55,30.61
VREFH
  Top 0.254: C11.1 40.49,36.13 R16.2 39.44,33.64 U1.14
VREFL  (via drill 0.6)
  Top 0.254: U1.15 U1.16 38.09,35.44 40.18,37.54 41.52,37.54 C11.2 | C11.2 42.7,36.36 C17.2 43.71,33.84 43.71,33.05 44.44,32.32 L4.2 | v43.89,36.52 42.58,36.52 C11.2 | C16.2 42.3,30.24 v43.2,29.34
  Bottom 0.254: v43.89,36.52 44.07,36.35 44.07,29.67 43.74,29.34 v43.2,29.34
XTAL_IN
  Top 0.254: U$6.XTAL_IN/28 9.93,13.74 Y3.3 C23.1
XTAL_OUT
  Top 0.254: U$6.XTAL_OUT/27 8.87,14.24 6.9,16.2 Y3.1 6.82,16.63 C7.1 6.39,17.84